# Altium schematic sheet MCU_STM32.SchDoc
size A3; DocumentNumber: 4; SheetNumber: 4; SheetTotal: 6
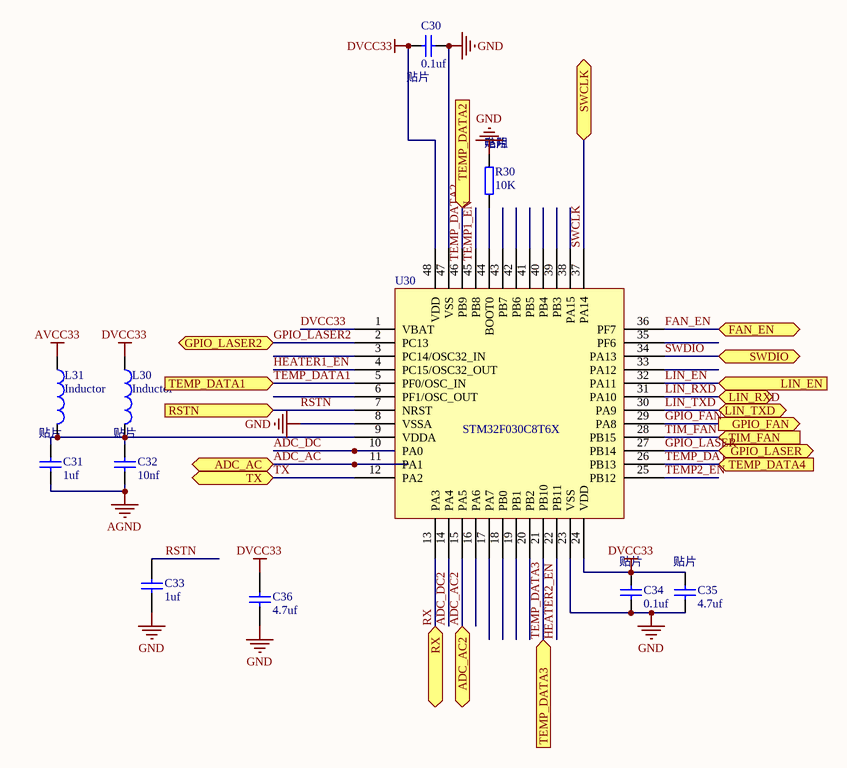
[diagram p0: MCU_STM32.SchDoc]

## Parts
C30  0.1uf  [C0402]
C31  1uf  [C0402]
C32  10nf  [C0402]
C33  1uf  [C0402]
C34  0.1uf  [C0402]
C35  4.7uf  [C0402]
C36  4.7uf  [C0402]
L30  Inductor  [L0402]
L31  Inductor  [L0402]
R30  10K  [R0402]
U30  STM32F030C8T6X  [LQFP48S]

## Ports
ADC_AC, ADC_AC2, FAN_EN, GPIO_FAN (out), GPIO_LASER, GPIO_LASER2, LIN_EN (in), LIN_RXD, LIN_TXD, RSTN (in), RX, SWCLK, SWDIO, TEMP_DATA1 (in), TEMP_DATA2 (in), TEMP_DATA3 (in), TEMP_DATA4 (in), TIM_FAN (in), TX

## Nets
AGND: C31.2 C32.2
AVCC33: L31.2
DVCC33: C30.1 C34.1 C35.1 C36.2 L30.2 U30.1(VBAT) U30.24(VDD) U30.48(VDD)
GND: C30.2 C33.1 C34.2 C35.2 C36.1 R30.1 U30.8(VSSA) U30.23(VSS) U30.47(VSS)
ADC_AC: U30.11(PA1) ; port ADC_AC
ADC_AC2: U30.15(PA5) ; port ADC_AC2
ADC_DC: U30.10(PA0)
ADC_DC2: U30.14(PA4)
FAN_EN: U30.36(PF7) ; port FAN_EN
GPIO_FAN: U30.29(PA8) ; port GPIO_FAN
GPIO_LASER: U30.27(PB14) ; port GPIO_LASER
GPIO_LASER2: U30.2(PC13) ; port GPIO_LASER2
HEATER1_EN: U30.4(PC15/OSC32_OUT)
HEATER2_EN: U30.22(PB11)
LIN_EN: U30.32(PA11) ; port LIN_EN
LIN_RXD: U30.31(PA10) ; port LIN_RXD
LIN_TXD: U30.30(PA9) ; port LIN_TXD
RSTN: C33.2 U30.7(NRST) ; port RSTN
RX: U30.13(PA3) ; port RX
SWCLK: U30.37(PA14) ; port SWCLK
SWDIO: U30.34(PA13) ; port SWDIO
TEMP2_EN: U30.25(PB12)
TEMP_DATA1: U30.5(PF0/OSC_IN) ; port TEMP_DATA1
TEMP_DATA2: U30.46(PB9) ; port TEMP_DATA2
TEMP_DATA3: U30.21(PB10) ; port TEMP_DATA3
TEMP_DATA4: U30.26(PB13) ; port TEMP_DATA4
TIM_FAN: U30.28(PB15) ; port TIM_FAN
TX: U30.12(PA2) ; port TX
NetC31_1: C31.1 C32.1 L30.1 L31.1 U30.9(VDDA)
NetR30_2: R30.2 U30.44(BOOT0)

Not connected (* = marked no-connect by the designer): U30 3(PC14/OSC32_IN) 6(PF1/OSC_OUT) 16(PA6) 17(PA7) 18(PB0) 19(PB1) 20(PB2) 33(PA12) 35(PF6) 38(PA15) 39(PB3) 40(PB4) 41(PB5) 42(PB6) 43(PB7) 45(PB8)

## Notes on the sheet
- Labels drawn without touching a wire or pin: TEMP1_EN, TEMP_DATA2
- (in symbol Cap Semi) 贴片
- (in symbol RES1) 电阻; 贴片

## Library data of the parts
C30 C34 = Cap Semi: Capacitor (Semiconductor SIM Model); 大?: 0.1uf/50v; 封?: 0603; 产?: *; 厂?: *; 型?: *; 物?: *
C31 = Cap Semi: Capacitor (Semiconductor SIM Model); 大?: 1uf/16v; 封?: 0603; 产?: *; 厂?: *; 型?: *; 物?: *
C32 C35 = Cap Semi: Capacitor (Semiconductor SIM Model); 封?: 0603; 产?: *; 厂?: *; 型?: *; 物?: *
  C32: 大?: 10nf
  C35: 大?: 4.7uf
C33 = C0402: Capacitor 0402; Value: 1uf/16v; Published: 8-Jun-2000; LatestRevisionDate: 17-Jul-2002; LatestRevisionNote: Re-released for DXP Platform.; PackageReference: RAD-0.3; Publisher: Altium Limited; PackageDescription: Radial Cap, Thru-Hole; 2 Leads; 0.3 in Pin Spacing
C36 = C0402: Capacitor 0402; Published: 8-Jun-2000; LatestRevisionDate: 17-Jul-2002; LatestRevisionNote: Re-released for DXP Platform.; PackageReference: RAD-0.3; Publisher: Altium Limited; PackageDescription: Radial Cap, Thru-Hole; 2 Leads; 0.3 in Pin Spacing; Value: 4.7uf
L30 L31 = Inductor: Code_IEC: 1005; Published: 8-Jun-2000; LatestRevisionDate: 29-May-2009; LatestRevisionNote: IPC-7351 Footprint Added.; PackageReference: 0402-A; Publisher: Altium Limited; PackageDescription: Chip Inductor; Code_JEITA: 0402
R30 = RES1: 价?: 0.01; 封?: 0603; 大?: 10K